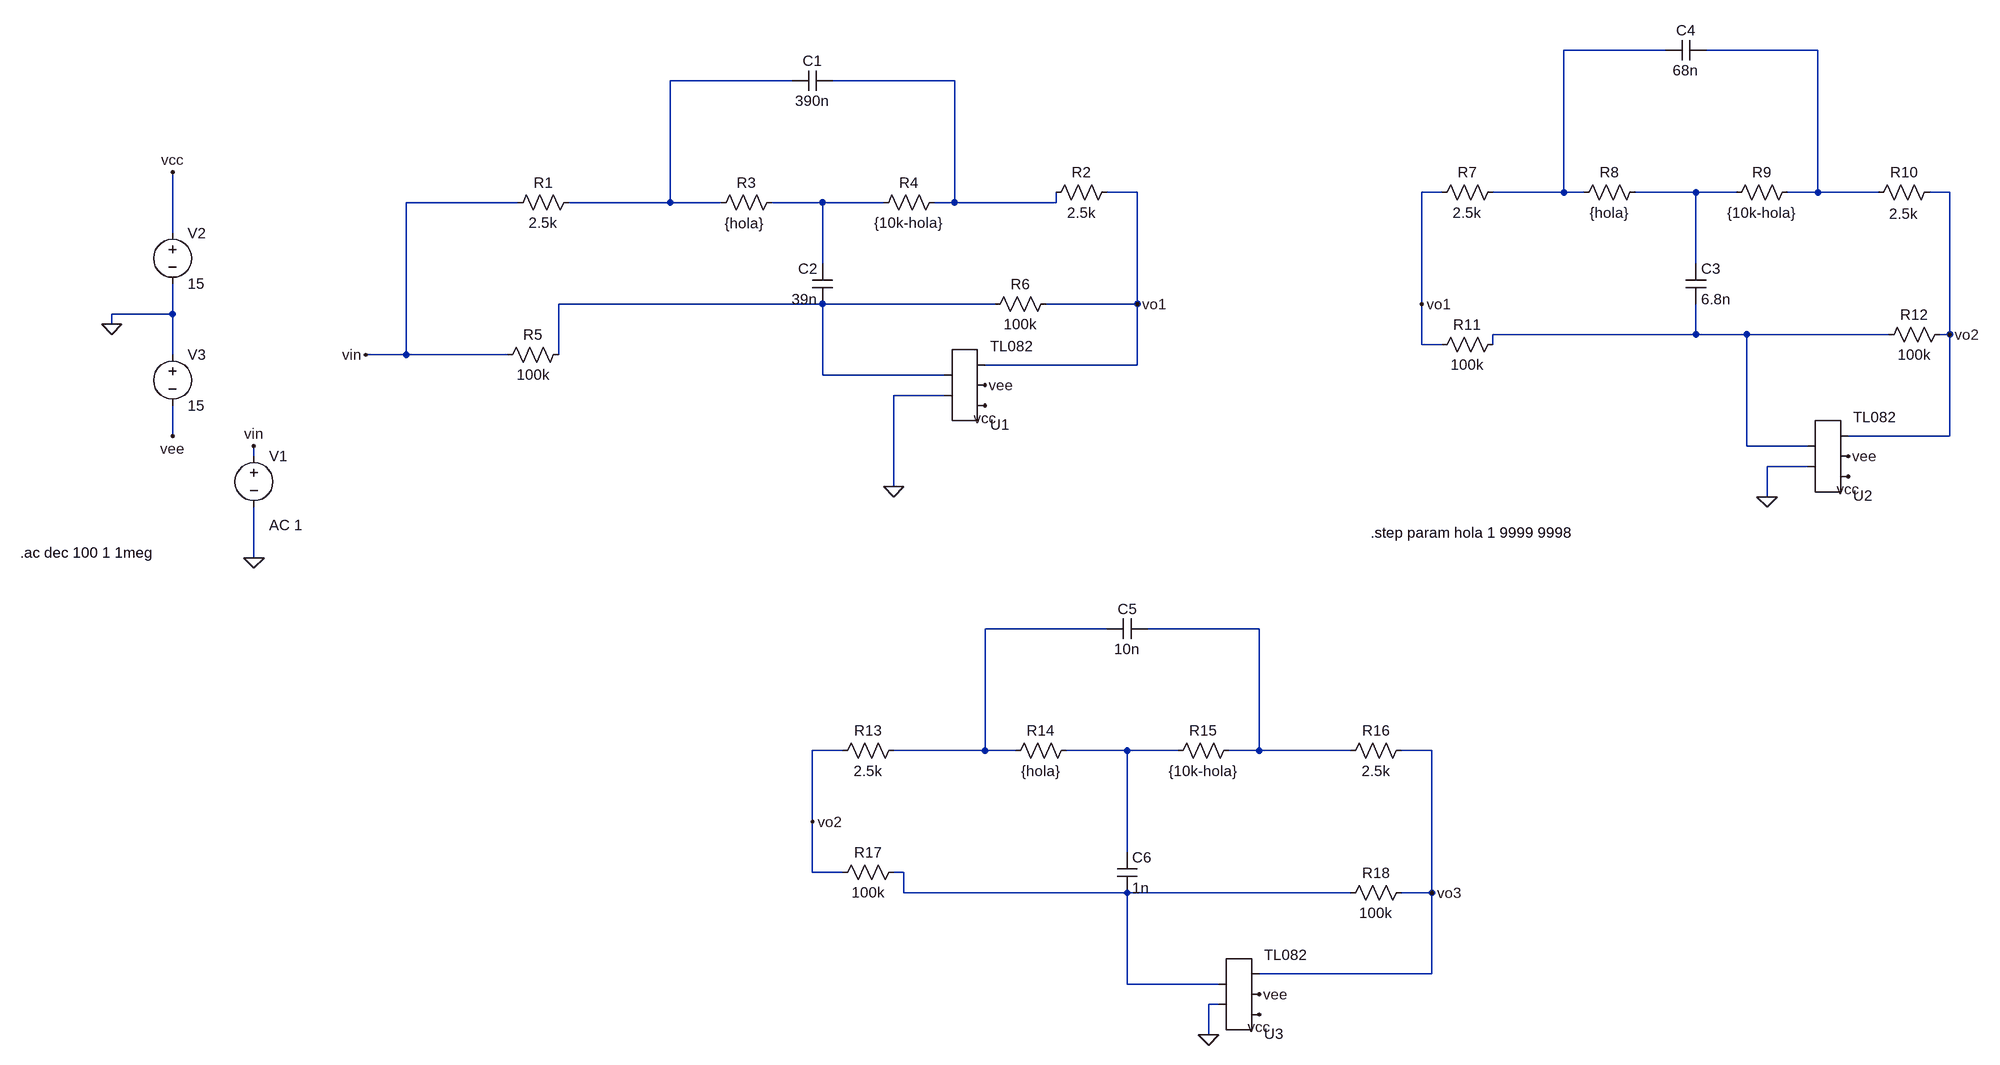
[diagram p0: schematic Spice.asc]
Spice.asc, the LTspice schematic file:
Version 4
SHEET 1 2820 1228
WIRE 1408 -352 1248 -352
WIRE 1648 -352 1472 -352
WIRE 32 -304 -160 -304
WIRE 288 -304 96 -304
WIRE 576 -128 528 -128
WIRE 1056 -128 1024 -128
WIRE 1248 -128 1248 -352
WIRE 1248 -128 1136 -128
WIRE 1280 -128 1248 -128
WIRE 1456 -128 1360 -128
WIRE 1520 -128 1456 -128
WIRE 1648 -128 1648 -352
WIRE 1648 -128 1600 -128
WIRE 1744 -128 1648 -128
WIRE 1856 -128 1824 -128
WIRE -400 -112 -576 -112
WIRE -160 -112 -160 -304
WIRE -160 -112 -320 -112
WIRE -80 -112 -160 -112
WIRE 80 -112 0 -112
WIRE 176 -112 80 -112
WIRE 288 -112 288 -304
WIRE 288 -112 256 -112
WIRE 448 -112 448 -128
WIRE 448 -112 288 -112
WIRE -944 -64 -944 -160
WIRE 80 -16 80 -112
WIRE 1456 -16 1456 -128
WIRE 80 48 -336 48
WIRE 352 48 80 48
WIRE 576 48 576 -128
WIRE 576 48 432 48
WIRE 1024 48 1024 -128
WIRE -944 64 -944 16
WIRE -944 64 -1040 64
WIRE -1040 80 -1040 64
WIRE 1456 96 1456 48
WIRE 1456 96 1136 96
WIRE 1536 96 1456 96
WIRE 1760 96 1536 96
WIRE 1856 96 1856 -128
WIRE 1856 96 1840 96
WIRE 1024 112 1024 48
WIRE 1056 112 1024 112
WIRE 1136 112 1136 96
WIRE -944 128 -944 64
WIRE -576 128 -576 -112
WIRE -576 128 -640 128
WIRE -416 128 -576 128
WIRE -336 128 -336 48
WIRE 576 144 576 48
WIRE 576 144 336 144
WIRE 80 160 80 48
WIRE 272 160 80 160
WIRE 272 192 192 192
WIRE -944 256 -944 208
WIRE 1856 256 1856 96
WIRE 1856 256 1696 256
WIRE 1536 272 1536 96
WIRE 1632 272 1536 272
WIRE -816 288 -816 272
WIRE 1632 304 1568 304
WIRE 192 336 192 192
WIRE 1568 352 1568 304
WIRE -816 448 -816 368
WIRE 528 560 336 560
WIRE 768 560 592 560
WIRE 112 752 64 752
WIRE 336 752 336 560
WIRE 336 752 192 752
WIRE 384 752 336 752
WIRE 560 752 464 752
WIRE 640 752 560 752
WIRE 768 752 768 560
WIRE 768 752 720 752
WIRE 912 752 768 752
WIRE 1040 752 992 752
WIRE 64 864 64 752
WIRE 560 912 560 752
WIRE 64 944 64 864
WIRE 112 944 64 944
WIRE 208 944 192 944
WIRE 208 976 208 944
WIRE 560 976 560 960
WIRE 560 976 208 976
WIRE 912 976 560 976
WIRE 1040 976 1040 752
WIRE 1040 976 992 976
WIRE 1040 1104 1040 976
WIRE 1040 1104 768 1104
WIRE 560 1120 560 976
WIRE 704 1120 560 1120
WIRE 704 1152 688 1152
WIRE 688 1200 688 1152
FLAG 192 336 0
FLAG -816 448 0
FLAG -1040 80 0
FLAG -944 -160 vcc
FLAG -944 256 vee
FLAG 336 208 vcc
FLAG 336 176 vee
FLAG 1696 320 vcc
FLAG 1696 288 vee
FLAG 1568 352 0
FLAG -816 272 vin
FLAG -640 128 vin
FLAG 1024 48 vo1
FLAG 768 1168 vcc
FLAG 768 1136 vee
FLAG 688 1200 0
FLAG 64 864 vo2
FLAG 576 48 vo1
FLAG 1856 96 vo2
FLAG 1040 976 vo3
SYMBOL res -304 -128 R90
WINDOW 0 0 56 VBottom 2
WINDOW 3 32 56 VTop 2
SYMATTR InstName R1
SYMATTR Value 2.5k
SYMBOL res 544 -144 R90
WINDOW 0 0 56 VBottom 2
WINDOW 3 32 56 VTop 2
SYMATTR InstName R2
SYMATTR Value 2.5k
SYMBOL res 16 -128 R90
WINDOW 0 0 56 VBottom 2
WINDOW 3 64 59 VBottom 2
SYMATTR InstName R3
SYMATTR Value {hola}
SYMBOL res 272 -128 R90
WINDOW 0 0 56 VBottom 2
WINDOW 3 32 56 VTop 2
SYMATTR InstName R4
SYMATTR Value {10k-hola}
SYMBOL res -320 112 R90
WINDOW 0 0 56 VBottom 2
WINDOW 3 32 56 VTop 2
SYMATTR InstName R5
SYMATTR Value 100k
SYMBOL res 448 32 R90
WINDOW 0 0 56 VBottom 2
WINDOW 3 32 56 VTop 2
SYMATTR InstName R6
SYMATTR Value 100k
SYMBOL cap 96 -320 R90
WINDOW 0 0 32 VBottom 2
WINDOW 3 32 32 VTop 2
SYMATTR InstName C1
SYMATTR Value 390n
SYMBOL cap 96 48 R180
WINDOW 0 24 56 Left 2
WINDOW 3 24 8 Left 2
SYMATTR InstName C2
SYMATTR Value 39n
SYMBOL voltage -816 272 R0
WINDOW 123 24 124 Left 2
WINDOW 39 0 0 Left 2
SYMATTR Value2 AC 1
SYMATTR InstName V1
SYMATTR Value ""
SYMBOL voltage -944 -80 R0
WINDOW 123 0 0 Left 2
WINDOW 39 0 0 Left 2
SYMATTR InstName V2
SYMATTR Value 15
SYMBOL voltage -944 112 R0
WINDOW 123 0 0 Left 2
WINDOW 39 0 0 Left 2
SYMATTR InstName V3
SYMATTR Value 15
SYMBOL AutoGenerated\\TL082 304 176 M180
SYMATTR InstName U1
SYMBOL res 1152 -144 R90
WINDOW 0 0 56 VBottom 2
WINDOW 3 32 56 VTop 2
SYMATTR InstName R7
SYMATTR Value 2.5k
SYMBOL res 1376 -144 R90
WINDOW 0 0 56 VBottom 2
WINDOW 3 32 56 VTop 2
SYMATTR InstName R8
SYMATTR Value {hola}
SYMBOL res 1616 -144 R90
WINDOW 0 0 56 VBottom 2
WINDOW 3 32 56 VTop 2
SYMATTR InstName R9
SYMATTR Value {10k-hola}
SYMBOL res 1840 -144 R90
WINDOW 0 0 56 VBottom 2
WINDOW 3 34 57 VTop 2
SYMATTR InstName R10
SYMATTR Value 2.5k
SYMBOL res 1152 96 R90
WINDOW 0 0 56 VBottom 2
WINDOW 3 32 56 VTop 2
SYMATTR InstName R11
SYMATTR Value 100k
SYMBOL res 1856 80 R90
WINDOW 0 0 56 VBottom 2
WINDOW 3 32 56 VTop 2
SYMATTR InstName R12
SYMATTR Value 100k
SYMBOL cap 1440 -16 R0
SYMATTR InstName C3
SYMATTR Value 6.8n
SYMBOL cap 1472 -368 R90
WINDOW 0 0 32 VBottom 2
WINDOW 3 32 32 VTop 2
SYMATTR InstName C4
SYMATTR Value 68n
SYMBOL AutoGenerated\\TL082 1664 288 M180
SYMATTR InstName U2
SYMBOL res 208 736 R90
WINDOW 0 0 56 VBottom 2
WINDOW 3 32 56 VTop 2
SYMATTR InstName R13
SYMATTR Value 2.5k
SYMBOL res 480 736 R90
WINDOW 0 0 56 VBottom 2
WINDOW 3 32 56 VTop 2
SYMATTR InstName R14
SYMATTR Value {hola}
SYMBOL res 736 736 R90
WINDOW 0 0 56 VBottom 2
WINDOW 3 32 56 VTop 2
SYMATTR InstName R15
SYMATTR Value {10k-hola}
SYMBOL res 1008 736 R90
WINDOW 0 0 56 VBottom 2
WINDOW 3 32 56 VTop 2
SYMATTR InstName R16
SYMATTR Value 2.5k
SYMBOL res 208 928 R90
WINDOW 0 0 56 VBottom 2
WINDOW 3 32 56 VTop 2
SYMATTR InstName R17
SYMATTR Value 100k
SYMBOL res 1008 960 R90
WINDOW 0 0 56 VBottom 2
WINDOW 3 32 56 VTop 2
SYMATTR InstName R18
SYMATTR Value 100k
SYMBOL cap 592 544 R90
WINDOW 0 0 32 VBottom 2
WINDOW 3 32 32 VTop 2
SYMATTR InstName C5
SYMATTR Value 10n
SYMBOL cap 544 912 R0
SYMATTR InstName C6
SYMATTR Value 1n
SYMBOL AutoGenerated\\TL082 736 1136 M180
SYMATTR InstName U3
TEXT -1184 440 Left 2 !.ac dec 100 1 1meg
TEXT 944 408 Left 2 !.step param hola 1 9999 9998

The netlist it stands for:
* Spice.asc
R1 N003 vin 2.5k
R2 vo1 N004 2.5k
R3 N006 N003 {hola}
R4 N004 N006 {10k-hola}
R5 N007 vin 100k
R6 vo1 N007 100k
C1 N004 N003 390n
C2 N007 N006 39n
V1 vin 0 AC 1
V2 vcc 0 15
V3 0 vee 15
* U1: TL082 (symbol AutoGenerated\TL082 not available, pins judged from their places): pin1=0 pin2=N007 pin3=vcc pin4=vee pin5=vo1
R7 N001 vo1 2.5k
R8 N005 N001 {hola}
R9 N002 N005 {10k-hola}
R10 vo2 N002 2.5k
R11 N008 vo1 100k
R12 vo2 N008 100k
C3 N005 N008 6.8n
C4 N002 N001 68n
* U2: TL082 (symbol AutoGenerated\TL082 not available, pins judged from their places): pin1=0 pin2=N008 pin3=vcc pin4=vee pin5=vo2
R13 N009 vo2 2.5k
R14 N011 N009 {hola}
R15 N010 N011 {10k-hola}
R16 vo3 N010 2.5k
R17 N012 vo2 100k
R18 vo3 N012 100k
C5 N010 N009 10n
C6 N011 N012 1n
* U3: TL082 (symbol AutoGenerated\TL082 not available, pins judged from their places): pin1=0 pin2=N012 pin3=vcc pin4=vee pin5=vo3
.ac dec 100 1 1meg
.step param hola 1 9999 9998
.backanno
.end